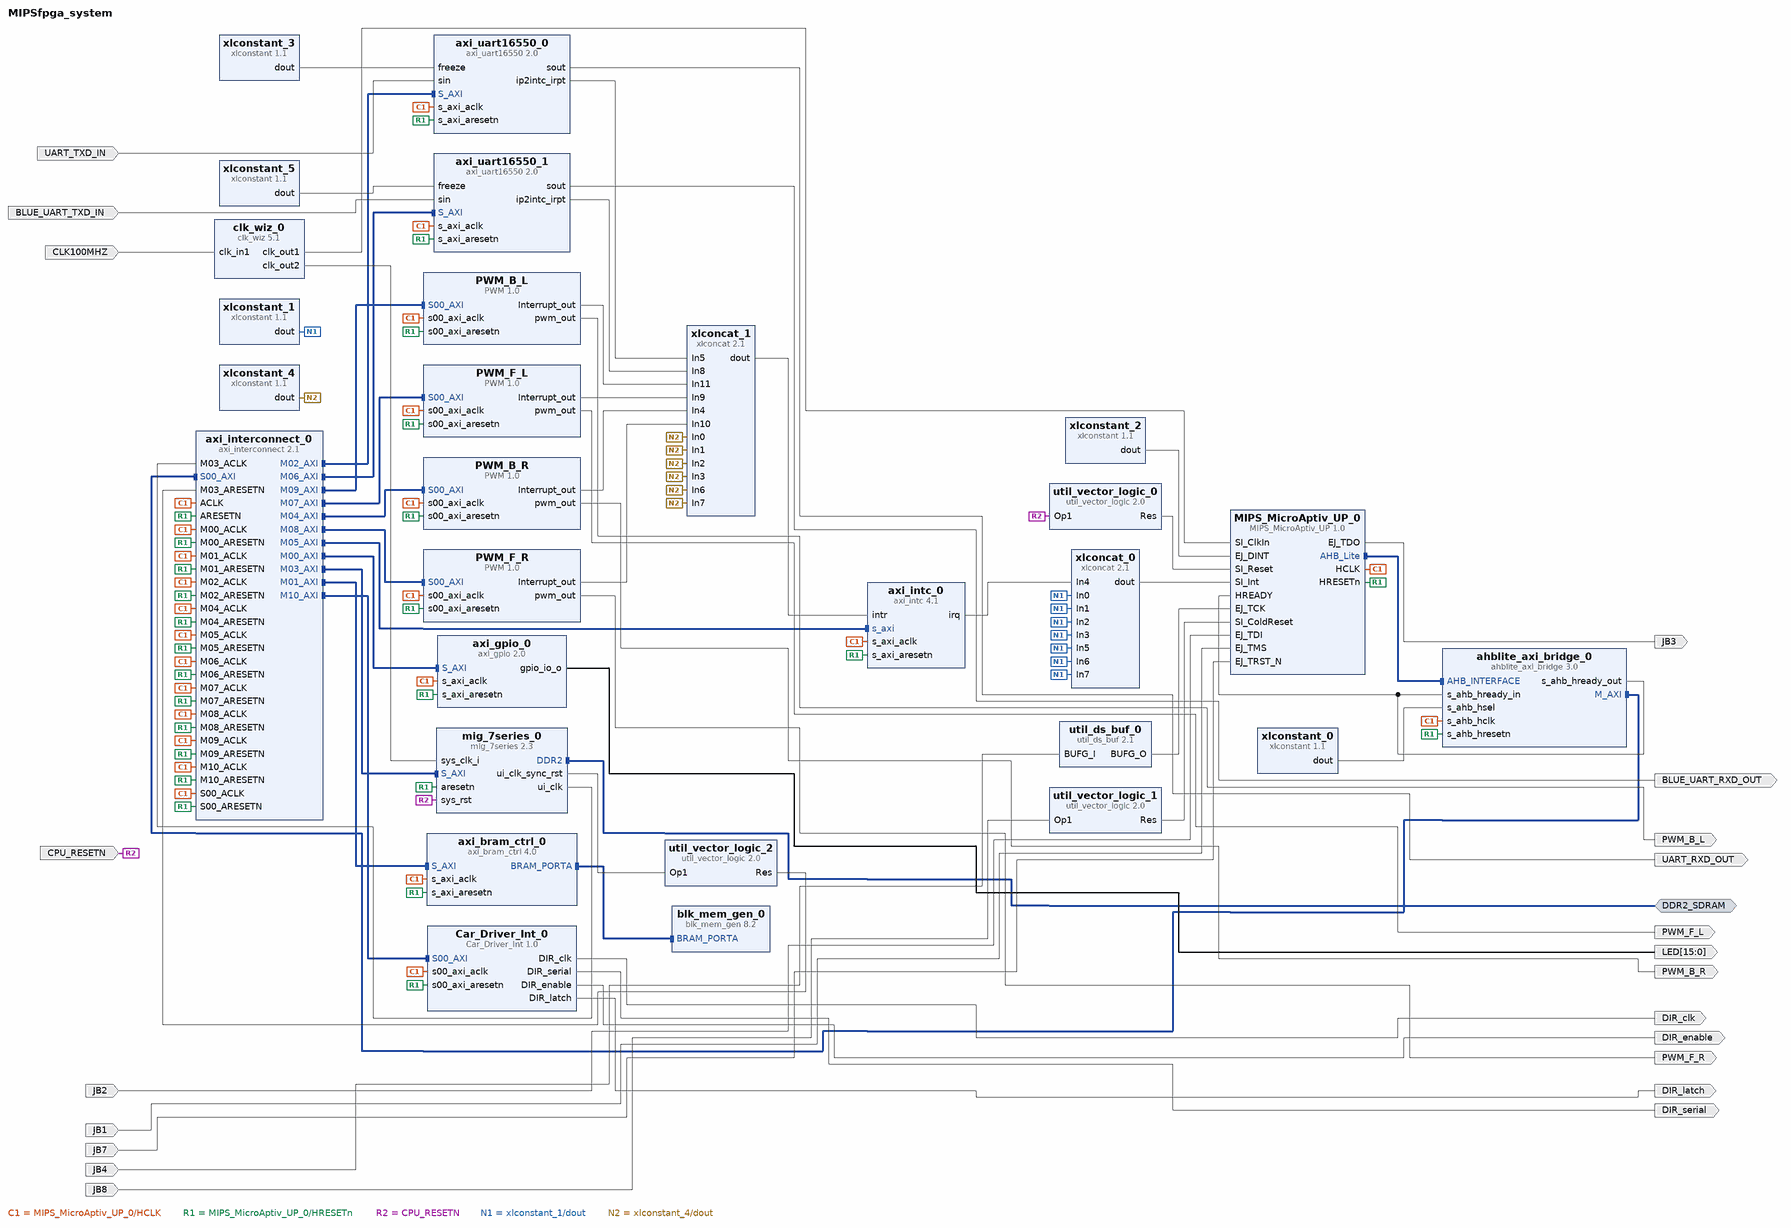
[diagram p0: block diagram of the top level]
# Vivado block design MIPSfpga_system, Vivado 2015.2
create_bd_design MIPSfpga_system

create_bd_intf_port -mode Master -vlnv xilinx.com:interface:ddrx_rtl:1.0 DDR2_SDRAM
create_bd_port -dir I JB2
create_bd_port -dir I JB1
create_bd_port -dir I JB7
create_bd_port -dir I JB4
create_bd_port -dir O JB3
create_bd_port -dir O -from 15 -to 0 LED
create_bd_port -dir I CLK100MHZ
create_bd_port -dir I CPU_RESETN
create_bd_port -dir I JB8
create_bd_port -dir I UART_TXD_IN
create_bd_port -dir O UART_RXD_OUT
create_bd_port -dir I BLUE_UART_TXD_IN
create_bd_port -dir O BLUE_UART_RXD_OUT
create_bd_port -dir O PWM_F_L
create_bd_port -dir O PWM_B_L
create_bd_port -dir O PWM_B_R
create_bd_port -dir O PWM_F_R
create_bd_port -dir O DIR_clk
create_bd_port -dir O DIR_serial
create_bd_port -dir O DIR_enable
create_bd_port -dir O DIR_latch

create_bd_cell -type ip -vlnv xilinx.com:ip:axi_interconnect:2.1 axi_interconnect_0
set_property -dict {CONFIG.NUM_MI 11} [get_bd_cells axi_interconnect_0]
create_bd_cell -type ip -vlnv xilinx.com:ip:axi_bram_ctrl:4.0 axi_bram_ctrl_0
set_property -dict {CONFIG.SINGLE_PORT_BRAM 1} [get_bd_cells axi_bram_ctrl_0]
create_bd_cell -type ip -vlnv xilinx.com:ip:xlconstant:1.1 xlconstant_0
create_bd_cell -type ip -vlnv xilinx.com:ip:blk_mem_gen:8.2 blk_mem_gen_0
set_property -dict [list \
  CONFIG.Enable_32bit_Address false \
  CONFIG.Use_Byte_Write_Enable false \
  CONFIG.Register_PortA_Output_of_Memory_Primitives false \
  CONFIG.Load_Init_File true \
  CONFIG.Coe_File ../../../../new/ram_init_os.coe \
  CONFIG.Use_RSTA_Pin false \
  CONFIG.use_bram_block Stand_Alone \
] [get_bd_cells blk_mem_gen_0]
create_bd_cell -type ip -vlnv xilinx.com:ip:util_ds_buf:2.1 util_ds_buf_0
set_property -dict {CONFIG.C_SIZE 1 CONFIG.C_BUF_TYPE BUFG} [get_bd_cells util_ds_buf_0]
create_bd_cell -type ip -vlnv xilinx.com:ip:xlconstant:1.1 xlconstant_1
set_property -dict {CONFIG.CONST_WIDTH 1 CONFIG.CONST_VAL 0} [get_bd_cells xlconstant_1]
create_bd_cell -type ip -vlnv xilinx.com:ip:xlconstant:1.1 xlconstant_2
set_property -dict {CONFIG.CONST_VAL 0} [get_bd_cells xlconstant_2]
create_bd_cell -type ip -vlnv xilinx.com:ip:util_vector_logic:2.0 util_vector_logic_0
set_property -dict {CONFIG.C_SIZE 1 CONFIG.C_OPERATION not} [get_bd_cells util_vector_logic_0]
create_bd_cell -type ip -vlnv xilinx.com:ip:util_vector_logic:2.0 util_vector_logic_1
set_property -dict {CONFIG.C_SIZE 1 CONFIG.C_OPERATION not} [get_bd_cells util_vector_logic_1]
create_bd_cell -type ip -vlnv xilinx.com:ip:ahblite_axi_bridge:3.0 ahblite_axi_bridge_0
create_bd_cell -type ip -vlnv xilinx.com:user:MIPS_MicroAptiv_UP:1.0 MIPS_MicroAptiv_UP_0
create_bd_cell -type ip -vlnv xilinx.com:ip:xlconstant:1.1 xlconstant_3
set_property -dict {CONFIG.CONST_VAL 0} [get_bd_cells xlconstant_3]
create_bd_cell -type ip -vlnv xilinx.com:ip:util_vector_logic:2.0 util_vector_logic_2
set_property -dict {CONFIG.C_SIZE 1 CONFIG.C_OPERATION not} [get_bd_cells util_vector_logic_2]
create_bd_cell -type ip -vlnv xilinx.com:ip:xlconcat:2.1 xlconcat_0
set_property -dict {CONFIG.NUM_PORTS 8} [get_bd_cells xlconcat_0]
create_bd_cell -type ip -vlnv xilinx.com:ip:axi_intc:4.1 axi_intc_0
create_bd_cell -type ip -vlnv xilinx.com:ip:xlconcat:2.1 xlconcat_1
set_property -dict {CONFIG.NUM_PORTS 12} [get_bd_cells xlconcat_1]
create_bd_cell -type ip -vlnv xilinx.com:ip:xlconstant:1.1 xlconstant_4
set_property -dict {CONFIG.CONST_WIDTH 1 CONFIG.CONST_VAL 0} [get_bd_cells xlconstant_4]
create_bd_cell -type ip -vlnv xilinx.com:ip:axi_uart16550:2.0 axi_uart16550_1
create_bd_cell -type ip -vlnv xilinx.com:ip:xlconstant:1.1 xlconstant_5
set_property -dict {CONFIG.CONST_VAL 0} [get_bd_cells xlconstant_5]
create_bd_cell -type ip -vlnv xilinx.com:ip:axi_gpio:2.0 axi_gpio_0
set_property -dict {CONFIG.C_GPIO_WIDTH 16 CONFIG.C_ALL_OUTPUTS 1} [get_bd_cells axi_gpio_0]
create_bd_cell -type ip -vlnv xilinx.com:ip:axi_uart16550:2.0 axi_uart16550_0
create_bd_cell -type ip -vlnv xilinx.com:ip:clk_wiz:5.1 clk_wiz_0
set_property -dict [list \
  CONFIG.PRIMITIVE PLL \
  CONFIG.CLKOUT2_USED true \
  CONFIG.NUM_OUT_CLKS 2 \
  CONFIG.CLKOUT1_REQUESTED_OUT_FREQ 50.000 \
  CONFIG.CLKOUT2_REQUESTED_OUT_FREQ 200.000 \
  CONFIG.CLKOUT1_DRIVES BUFG \
  CONFIG.CLKOUT2_DRIVES BUFG \
  CONFIG.CLKOUT3_DRIVES BUFG \
  CONFIG.CLKOUT4_DRIVES BUFG \
  CONFIG.CLKOUT5_DRIVES BUFG \
  CONFIG.CLKOUT6_DRIVES BUFG \
  CONFIG.CLKOUT7_DRIVES BUFG \
  CONFIG.USE_LOCKED false \
  CONFIG.USE_RESET false \
  CONFIG.MMCM_DIVCLK_DIVIDE 1 \
  CONFIG.MMCM_CLKFBOUT_MULT_F 8 \
  CONFIG.MMCM_COMPENSATION ZHOLD \
  CONFIG.MMCM_CLKOUT0_DIVIDE_F 16 \
  CONFIG.MMCM_CLKOUT1_DIVIDE 4 \
  CONFIG.CLKOUT1_JITTER 167.017 \
  CONFIG.CLKOUT1_PHASE_ERROR 114.212 \
  CONFIG.CLKOUT2_JITTER 126.455 \
  CONFIG.CLKOUT2_PHASE_ERROR 114.212 \
] [get_bd_cells clk_wiz_0]
create_bd_cell -type ip -vlnv xilinx.com:ip:mig_7series:2.3 mig_7series_0
set_property -dict [list \
  CONFIG.XML_INPUT_FILE mig_a.prj \
  CONFIG.RESET_BOARD_INTERFACE Custom \
  CONFIG.MIG_DONT_TOUCH_PARAM Custom \
  CONFIG.BOARD_MIG_PARAM Custom \
] [get_bd_cells mig_7series_0]
create_bd_cell -type ip -vlnv xilinx.com:user:PWM:1.0 PWM_F_L
create_bd_cell -type ip -vlnv xilinx.com:user:PWM:1.0 PWM_F_R
create_bd_cell -type ip -vlnv xilinx.com:user:PWM:1.0 PWM_B_L
create_bd_cell -type ip -vlnv xilinx.com:user:PWM:1.0 PWM_B_R
create_bd_cell -type ip -vlnv xilinx.com:user:Car_Driver_Int:1.0 Car_Driver_Int_0

# ---- connections ----

connect_bd_intf_net [get_bd_intf_pins axi_interconnect_0/M00_AXI] [get_bd_intf_pins axi_gpio_0/S_AXI]
connect_bd_intf_net [get_bd_intf_pins axi_interconnect_0/M01_AXI] [get_bd_intf_pins axi_bram_ctrl_0/S_AXI]
connect_bd_intf_net [get_bd_intf_pins axi_bram_ctrl_0/BRAM_PORTA] [get_bd_intf_pins blk_mem_gen_0/BRAM_PORTA]
connect_bd_intf_net [get_bd_intf_pins MIPS_MicroAptiv_UP_0/AHB_Lite] [get_bd_intf_pins ahblite_axi_bridge_0/AHB_INTERFACE]
connect_bd_intf_net [get_bd_intf_pins ahblite_axi_bridge_0/M_AXI] [get_bd_intf_pins axi_interconnect_0/S00_AXI]
connect_bd_intf_net [get_bd_intf_pins axi_interconnect_0/M02_AXI] [get_bd_intf_pins axi_uart16550_0/S_AXI]
connect_bd_intf_net [get_bd_intf_pins axi_interconnect_0/M03_AXI] [get_bd_intf_pins mig_7series_0/S_AXI]
connect_bd_intf_net [get_bd_intf_pins axi_intc_0/s_axi] [get_bd_intf_pins axi_interconnect_0/M05_AXI]
connect_bd_intf_net [get_bd_intf_pins axi_uart16550_1/S_AXI] [get_bd_intf_pins axi_interconnect_0/M06_AXI]
connect_bd_intf_net [get_bd_intf_pins PWM_F_L/S00_AXI] [get_bd_intf_pins axi_interconnect_0/M07_AXI]
connect_bd_intf_net [get_bd_intf_pins axi_interconnect_0/M08_AXI] [get_bd_intf_pins PWM_F_R/S00_AXI]
connect_bd_intf_net [get_bd_intf_pins axi_interconnect_0/M09_AXI] [get_bd_intf_pins PWM_B_L/S00_AXI]
connect_bd_intf_net [get_bd_intf_pins PWM_B_R/S00_AXI] [get_bd_intf_pins axi_interconnect_0/M04_AXI]
connect_bd_intf_net [get_bd_intf_pins axi_interconnect_0/M10_AXI] [get_bd_intf_pins Car_Driver_Int_0/S00_AXI]
connect_bd_intf_net [get_bd_intf_ports DDR2_SDRAM] [get_bd_intf_pins mig_7series_0/DDR2]
connect_bd_net [get_bd_pins MIPS_MicroAptiv_UP_0/HCLK] \
  [get_bd_pins axi_bram_ctrl_0/s_axi_aclk] [get_bd_pins ahblite_axi_bridge_0/s_ahb_hclk] [get_bd_pins axi_intc_0/s_axi_aclk] \
  [get_bd_pins axi_uart16550_1/s_axi_aclk] [get_bd_pins axi_gpio_0/s_axi_aclk] [get_bd_pins axi_uart16550_0/s_axi_aclk] \
  [get_bd_pins PWM_F_L/s00_axi_aclk] [get_bd_pins PWM_F_R/s00_axi_aclk] [get_bd_pins PWM_B_L/s00_axi_aclk] \
  [get_bd_pins PWM_B_R/s00_axi_aclk] [get_bd_pins axi_interconnect_0/ACLK] [get_bd_pins axi_interconnect_0/S00_ACLK] \
  [get_bd_pins axi_interconnect_0/M00_ACLK] [get_bd_pins axi_interconnect_0/M01_ACLK] \
  [get_bd_pins axi_interconnect_0/M02_ACLK] [get_bd_pins axi_interconnect_0/M04_ACLK] \
  [get_bd_pins axi_interconnect_0/M05_ACLK] [get_bd_pins axi_interconnect_0/M06_ACLK] \
  [get_bd_pins axi_interconnect_0/M07_ACLK] [get_bd_pins axi_interconnect_0/M08_ACLK] \
  [get_bd_pins axi_interconnect_0/M09_ACLK] [get_bd_pins axi_interconnect_0/M10_ACLK] \
  [get_bd_pins Car_Driver_Int_0/s00_axi_aclk]
connect_bd_net [get_bd_pins MIPS_MicroAptiv_UP_0/HRESETn] \
  [get_bd_pins axi_bram_ctrl_0/s_axi_aresetn] [get_bd_pins ahblite_axi_bridge_0/s_ahb_hresetn] \
  [get_bd_pins axi_intc_0/s_axi_aresetn] [get_bd_pins axi_uart16550_1/s_axi_aresetn] [get_bd_pins axi_gpio_0/s_axi_aresetn] \
  [get_bd_pins axi_uart16550_0/s_axi_aresetn] [get_bd_pins mig_7series_0/aresetn] [get_bd_pins PWM_F_L/s00_axi_aresetn] \
  [get_bd_pins PWM_B_L/s00_axi_aresetn] [get_bd_pins PWM_F_R/s00_axi_aresetn] [get_bd_pins PWM_B_R/s00_axi_aresetn] \
  [get_bd_pins axi_interconnect_0/ARESETN] [get_bd_pins axi_interconnect_0/S00_ARESETN] \
  [get_bd_pins axi_interconnect_0/M00_ARESETN] [get_bd_pins axi_interconnect_0/M01_ARESETN] \
  [get_bd_pins axi_interconnect_0/M02_ARESETN] [get_bd_pins axi_interconnect_0/M04_ARESETN] \
  [get_bd_pins axi_interconnect_0/M05_ARESETN] [get_bd_pins axi_interconnect_0/M06_ARESETN] \
  [get_bd_pins axi_interconnect_0/M07_ARESETN] [get_bd_pins axi_interconnect_0/M08_ARESETN] \
  [get_bd_pins axi_interconnect_0/M09_ARESETN] [get_bd_pins axi_interconnect_0/M10_ARESETN] \
  [get_bd_pins Car_Driver_Int_0/s00_axi_aresetn]
connect_bd_net -net EJ_TDI_1 [get_bd_ports JB2] [get_bd_pins MIPS_MicroAptiv_UP_0/EJ_TDI]
connect_bd_net -net EJ_TMS_1 [get_bd_ports JB1] [get_bd_pins MIPS_MicroAptiv_UP_0/EJ_TMS]
connect_bd_net -net EJ_TRST_N_1 [get_bd_ports JB7] [get_bd_pins MIPS_MicroAptiv_UP_0/EJ_TRST_N]
connect_bd_net [get_bd_pins util_ds_buf_0/BUFG_O] [get_bd_pins MIPS_MicroAptiv_UP_0/EJ_TCK]
connect_bd_net -net EJ_TCK_1 [get_bd_ports JB4] [get_bd_pins util_ds_buf_0/BUFG_I]
connect_bd_net [get_bd_pins xlconstant_2/dout] [get_bd_pins MIPS_MicroAptiv_UP_0/EJ_DINT]
connect_bd_net [get_bd_pins MIPS_MicroAptiv_UP_0/EJ_TDO] [get_bd_ports JB3]
connect_bd_net [get_bd_pins axi_gpio_0/gpio_io_o] [get_bd_ports LED]
connect_bd_net [get_bd_pins clk_wiz_0/clk_out1] [get_bd_pins MIPS_MicroAptiv_UP_0/SI_ClkIn]
connect_bd_net -net SI_ClkIn_1 [get_bd_ports CLK100MHZ] [get_bd_pins clk_wiz_0/clk_in1]
connect_bd_net [get_bd_pins util_vector_logic_0/Res] [get_bd_pins MIPS_MicroAptiv_UP_0/SI_Reset]
connect_bd_net -net SI_Reset_1 [get_bd_ports CPU_RESETN] [get_bd_pins util_vector_logic_0/Op1] [get_bd_pins mig_7series_0/sys_rst]
connect_bd_net [get_bd_pins util_vector_logic_1/Res] [get_bd_pins MIPS_MicroAptiv_UP_0/SI_ColdReset]
connect_bd_net -net SI_ColdReset_1 [get_bd_ports JB8] [get_bd_pins util_vector_logic_1/Op1]
connect_bd_net [get_bd_pins ahblite_axi_bridge_0/s_ahb_hready_out] \
  [get_bd_pins ahblite_axi_bridge_0/s_ahb_hready_in] [get_bd_pins MIPS_MicroAptiv_UP_0/HREADY]
connect_bd_net [get_bd_pins xlconstant_0/dout] [get_bd_pins ahblite_axi_bridge_0/s_ahb_hsel]
connect_bd_net [get_bd_pins xlconstant_3/dout] [get_bd_pins axi_uart16550_0/freeze]
connect_bd_net -net sin_1 [get_bd_ports UART_TXD_IN] [get_bd_pins axi_uart16550_0/sin]
connect_bd_net [get_bd_pins axi_uart16550_0/sout] [get_bd_ports UART_RXD_OUT]
connect_bd_net [get_bd_pins clk_wiz_0/clk_out2] [get_bd_pins mig_7series_0/sys_clk_i]
connect_bd_net [get_bd_pins mig_7series_0/ui_clk] [get_bd_pins axi_interconnect_0/M03_ACLK]
connect_bd_net [get_bd_pins mig_7series_0/ui_clk_sync_rst] [get_bd_pins util_vector_logic_2/Op1]
connect_bd_net [get_bd_pins util_vector_logic_2/Res] [get_bd_pins axi_interconnect_0/M03_ARESETN]
connect_bd_net [get_bd_pins xlconcat_0/dout] [get_bd_pins MIPS_MicroAptiv_UP_0/SI_Int]
connect_bd_net [get_bd_pins xlconstant_1/dout] \
  [get_bd_pins xlconcat_0/In0] [get_bd_pins xlconcat_0/In1] [get_bd_pins xlconcat_0/In2] [get_bd_pins xlconcat_0/In3] \
  [get_bd_pins xlconcat_0/In6] [get_bd_pins xlconcat_0/In7] [get_bd_pins xlconcat_0/In5]
connect_bd_net -net xlconstant_1_dout1 [get_bd_pins xlconstant_4/dout] \
  [get_bd_pins xlconcat_1/In0] [get_bd_pins xlconcat_1/In1] [get_bd_pins xlconcat_1/In2] [get_bd_pins xlconcat_1/In3] \
  [get_bd_pins xlconcat_1/In6] [get_bd_pins xlconcat_1/In7]
connect_bd_net [get_bd_pins xlconcat_1/dout] [get_bd_pins axi_intc_0/intr]
connect_bd_net [get_bd_pins axi_uart16550_0/ip2intc_irpt] [get_bd_pins xlconcat_1/In5]
connect_bd_net [get_bd_pins axi_intc_0/irq] [get_bd_pins xlconcat_0/In4]
connect_bd_net [get_bd_pins xlconstant_5/dout] [get_bd_pins axi_uart16550_1/freeze]
connect_bd_net [get_bd_pins axi_uart16550_1/ip2intc_irpt] [get_bd_pins xlconcat_1/In8]
connect_bd_net -net sin_2 [get_bd_ports BLUE_UART_TXD_IN] [get_bd_pins axi_uart16550_1/sin]
connect_bd_net [get_bd_pins axi_uart16550_1/sout] [get_bd_ports BLUE_UART_RXD_OUT]
connect_bd_net -net PWM_0_pwm_out [get_bd_pins PWM_F_L/pwm_out] [get_bd_ports PWM_F_L]
connect_bd_net -net PWM_0_Interrupt_out [get_bd_pins PWM_F_L/Interrupt_out] [get_bd_pins xlconcat_1/In9]
connect_bd_net [get_bd_pins PWM_B_L/pwm_out] [get_bd_ports PWM_B_L]
connect_bd_net [get_bd_pins PWM_B_R/pwm_out] [get_bd_ports PWM_B_R]
connect_bd_net [get_bd_pins PWM_F_R/Interrupt_out] [get_bd_pins xlconcat_1/In10]
connect_bd_net [get_bd_pins PWM_B_L/Interrupt_out] [get_bd_pins xlconcat_1/In11]
connect_bd_net [get_bd_pins PWM_F_R/pwm_out] [get_bd_ports PWM_F_R]
connect_bd_net [get_bd_pins PWM_B_R/Interrupt_out] [get_bd_pins xlconcat_1/In4]
connect_bd_net [get_bd_pins Car_Driver_Int_0/DIR_clk] [get_bd_ports DIR_clk]
connect_bd_net [get_bd_pins Car_Driver_Int_0/DIR_serial] [get_bd_ports DIR_serial]
connect_bd_net [get_bd_pins Car_Driver_Int_0/DIR_enable] [get_bd_ports DIR_enable]
connect_bd_net [get_bd_pins Car_Driver_Int_0/DIR_latch] [get_bd_ports DIR_latch]

# ---- address map ----
assign_bd_address -offset 0x00000000 -range 128M -target_address_space [get_bd_addr_spaces MIPS_MicroAptiv_UP_0/AHB_Lite] [get_bd_addr_segs mig_7series_0/memmap/memaddr]
assign_bd_address -offset 0x10200000 -range 64K -target_address_space [get_bd_addr_spaces MIPS_MicroAptiv_UP_0/AHB_Lite] [get_bd_addr_segs axi_intc_0/s_axi/Reg]
assign_bd_address -offset 0x10400000 -range 64K -target_address_space [get_bd_addr_spaces MIPS_MicroAptiv_UP_0/AHB_Lite] [get_bd_addr_segs axi_uart16550_0/S_AXI/Reg]
assign_bd_address -offset 0x10500000 -range 64K -target_address_space [get_bd_addr_spaces MIPS_MicroAptiv_UP_0/AHB_Lite] [get_bd_addr_segs axi_uart16550_1/S_AXI/Reg]
assign_bd_address -offset 0x10600000 -range 64K -target_address_space [get_bd_addr_spaces MIPS_MicroAptiv_UP_0/AHB_Lite] [get_bd_addr_segs axi_gpio_0/S_AXI/Reg]
assign_bd_address -offset 0x10700000 -range 64K -target_address_space [get_bd_addr_spaces MIPS_MicroAptiv_UP_0/AHB_Lite] [get_bd_addr_segs Car_Driver_Int_0/S00_AXI/S00_AXI_reg]
assign_bd_address -offset 0x10C00000 -range 64K -target_address_space [get_bd_addr_spaces MIPS_MicroAptiv_UP_0/AHB_Lite] [get_bd_addr_segs PWM_F_L/S00_AXI/S00_AXI_reg]
assign_bd_address -offset 0x10D00000 -range 64K -target_address_space [get_bd_addr_spaces MIPS_MicroAptiv_UP_0/AHB_Lite] [get_bd_addr_segs PWM_F_R/S00_AXI/S00_AXI_reg]
assign_bd_address -offset 0x10E00000 -range 64K -target_address_space [get_bd_addr_spaces MIPS_MicroAptiv_UP_0/AHB_Lite] [get_bd_addr_segs PWM_B_L/S00_AXI/S00_AXI_reg]
assign_bd_address -offset 0x10F00000 -range 64K -target_address_space [get_bd_addr_spaces MIPS_MicroAptiv_UP_0/AHB_Lite] [get_bd_addr_segs PWM_B_R/S00_AXI/S00_AXI_reg]
assign_bd_address -offset 0x1FC00000 -range 8K -target_address_space [get_bd_addr_spaces MIPS_MicroAptiv_UP_0/AHB_Lite] [get_bd_addr_segs axi_bram_ctrl_0/S_AXI/Mem0]

validate_bd_design
save_bd_design
